# Altium schematic sheet hdmi_to_8pin_header.SchDoc
size A4
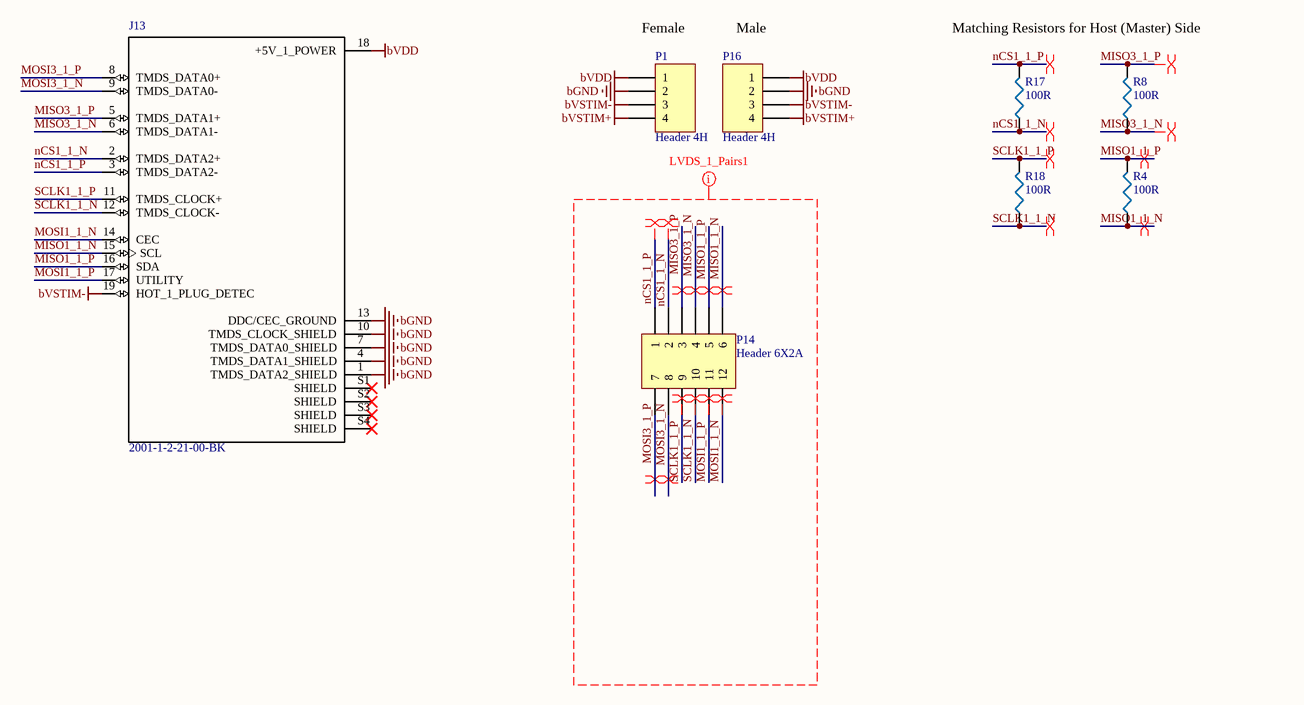
[diagram p0: hdmi_to_8pin_header.SchDoc]

## Parts
J13  2001-1-2-21-00-BK  [*CNC_2001-1-2-21-00-BK_2001-1-2-21-00-BK(Primary)]
P1  Header 4H  [PPTC041LGBN-RC]
P14  Header 6X2A  [PPPC062LJBN-RC]
P16  Header 4H  [PEC04SBAN]
R4  100R  [R0805]
R8  100R  [R0805]
R17  100R  [R0805]
R18  100R  [R0805]

## Nets
bGND: J13.1(TMDS_DATA2_SHIELD) J13.4(TMDS_DATA1_SHIELD) J13.7(TMDS_DATA0_SHIELD) J13.10(TMDS_CLOCK_SHIELD) J13.13(DDC/CEC_GROUND) P1.2 P16.2
bVDD: J13.18(+5V_1_POWER) P1.1 P16.1
bVSTIM+: P1.4 P16.4
bVSTIM-: J13.19(HOT_1_PLUG_DETEC) P1.3 P16.3
MISO1_1_N: J13.15(SCL) P14.6 R4.1
MISO1_1_P: J13.16(SDA) P14.5 R4.2
MISO3_1_N: J13.6(TMDS_DATA1-) P14.4 R8.1
MISO3_1_P: J13.5(TMDS_DATA1+) P14.3 R8.2
MOSI1_1_N: J13.14(CEC) P14.12
MOSI1_1_P: J13.17(UTILITY) P14.11
MOSI3_1_N: J13.9(TMDS_DATA0-) P14.8
MOSI3_1_P: J13.8(TMDS_DATA0+) P14.7
nCS1_1_N: J13.2(TMDS_DATA2+) P14.2 R17.1
nCS1_1_P: J13.3(TMDS_DATA2-) P14.1 R17.2
SCLK1_1_N: J13.12(TMDS_CLOCK-) P14.10 R18.1
SCLK1_1_P: J13.11(TMDS_CLOCK+) P14.9 R18.2

Not connected (* = marked no-connect by the designer): J13 S1(SHIELD)* S2(SHIELD)* S3(SHIELD)* S4(SHIELD)*

## Layout directives
differential pair: MISO1_1_N, MISO1_1_P, MISO3_1_N, MISO3_1_P, MOSI1_1_N, MOSI1_1_P, MOSI3_1_N, MOSI3_1_P, nCS1_1_N, nCS1_1_P, SCLK1_1_N, SCLK1_1_P
net class LVDS_1_Pairs1: MISO1_1_N, MISO1_1_P, MISO3_1_N, MISO3_1_P, MOSI1_1_N, MOSI1_1_P, MOSI3_1_N, MOSI3_1_P, nCS1_1_N, nCS1_1_P, SCLK1_1_N, SCLK1_1_P

## Notes on the sheet
- (near P1) Female
- (near P16) Male
- Matching Resistors for Host (Master) Side

## Library data of the parts
J13 = 2001-1-2-21-00-BK: Mini Hdmi 19p Female Smt; Manufacturer: CNC Tech; Pricing1: Price Break  Unit Price  Extended Price  1  2.69000  $2.69  10  2.43900  $24.39  25  2.28960  $57.24  50  2.19000  $109.50  100  2.09050  $209.05  250  1.89140  $472.85  500  1.74208  $871.04 (CAD); Digi-Key_Part_Number: 1175-1704-1-ND; Digi-Key_Purchase_URL: https://www.digikey.com/product-detail/en/cnc-tech/2001-1-2-21-00-BK/1175-1704-1-ND/4867013?utm_source=snapeda&utm_medium=aggregator&utm_campaign=symbol; Manufacturer Part Number: 2001-1-2-21-00-BK; SnapEDA_Link: https://www.snapeda.com/parts/2001-1-2-21-00-BK/CNC%20Tech/view-part/?ref=snap; Supplier 1: Digikey; Supplier Part Number 1: 1175-1704-1-ND; Supplier Link 1: https://www.digikey.ca/product-detail/en/cnc-tech/2001-1-2-21-00-BK/1175-1704-1-ND/4867013; Stock1: 3,276; ComponentLink1URL: http://cnctech.us/pdfs/2001-1-2-21-00-BK.pdf; ComponentLink1Description: Datasheet
P1 = Header 4H: Header, 4-Pin, Right Angle; Manufacturer: Sullins Connector Solutions; Pricing1: Price Break  Unit Price  Extended Price  1  0.79000  $0.79  10  0.73700  $7.37  100  0.56490  $56.49  500  0.49124  $245.62  1,000  0.40528  $405.28  5,000  0.35615  $1,780.73  10,000  0.35478  $3,547.80 (CAD); Detailed Description: 4 Position Header Connector 0.100" (2.54mm) Through Hole, Right Angle Tin; LatestRevisionDate: 17-Jul-2002; LatestRevisionNote: Re-released for DXP Platform.; Publisher: Altium Limited; Manufacturer Part Number: PPTC041LGBN-RC; Manufacturer Link: https://www.sullinscorp.com/product/?pn=PPTC041LGBN-RC&toggle=in; Supplier 1: Digikey; Supplier Part Number 1: S5440-ND; Supplier Link 1: https://www.digikey.ca/product-detail/en/sullins-connector-solutions/PPTC041LGBN-RC/S5440-ND/775898; Stock1: 12,644; ComponentLink1URL: https://drawings-pdf.s3.amazonaws.com/10493.pdf; ComponentLink1Description: Datasheet
P14 = Header 6X2A: Header, 6-Pin, Dual row; Manufacturer: Sullins Connector Solutions; Pricing1: 1  1.80000  $1.80  10  1.57700  $15.77  100  1.36070  $136.07  500  1.11330  $556.65  1,000  0.98959  $989.59  5,000  0.89338  $4,466.92 (CAD); LatestRevisionDate: 17-Jul-2002; LatestRevisionNote: Re-released for DXP Platform.; Publisher: Altium Limited; Manufacturer Part Number: PPPC062LJBN-RC; Manufacturer Link: https://www.sullinscorp.com/product/?pn=PPPC062LJBN-RC&toggle=in; Supplier 1: Digikey; Supplier Link 1: https://www.digikey.ca/product-detail/en/sullins-connector-solutions/PPPC062LJBN-RC/S5559-ND/776017; Supplier Part Number 1: S5559-ND; Stock1: 7,855; ComponentLink1URL: https://drawings-pdf.s3.amazonaws.com/10494.pdf; ComponentLink1Description: Datasheet
P16 = Header 4H: Header, 4-Pin, Right Angle; Manufacturer: Sullins Connector Solutions; pricing1: Price Break  Unit Price  Extended Price  1  0.54000  $0.54  10  0.50800  $5.08  25  0.43560  $10.89  50  0.37020  $18.51  100  0.35560  $35.56  250  0.31940  $79.85  500  0.30486  $152.43 (CAD); LatestRevisionDate: 17-Jul-2002; LatestRevisionNote: Re-released for DXP Platform.; Publisher: Altium Limited; Manufacturer Part Number: PEC04SBAN; Manufacturer Link: https://www.sullinscorp.com/product/?pn=PPPC181LFBN-RC&toggle=in#; Supplier 1: Digikey; Supplier Part Number 1: S1112E-04-ND; Supplier Link 1: https://www.digikey.ca/product-detail/en/sullins-connector-solutions/PEC04SBAN/S1112E-04-ND/860093; Stock1: 2,184; ComponentLink1URL: https://drawings-pdf.s3.amazonaws.com/10492.pdf; ComponentLink1Description: Datasheet
R4 R8 R17 R18 = RES100: ERJ-6ENF1000V; Manufacturer: Panasonic Electronic Components; Tolerance: 1%; Temperature Coefficient: 100ppm/°C; Power Rating: 125mW; Voltage Rating: 150V; Supplier 1: Digi-Key; Manufacturer Part Number: ERJ-6ENF1000V; Stock 1: 1859281; Pricing 1: 1=0.16;  10=0.15;  100=0.05760;  1000=0.02535;  2500=0.02190  (CAD); Case/Package: 0805; Case Code (Metric): 2012; Case Code (Imperial): 0805; Min Operating Temperature: -55°C; Max Operating Temperature: 155°C; Resistance: 100R; Packaging: Paper Tape; Composition: Thick Film; Package Quantity: 1; Number of Terminations: 2; Termination: SMD/SMT; Military Standard: Not; Max Power Dissipation: 125mW; REACH SVHC: Unknown; Lead Free: Lead Free; ComponentLink1URL: https://industrial.panasonic.com/cdbs/www-data/pdf/RDA0000/AOA0000C304.pdf; ComponentLink1Description: Datasheet; ComponentLink2URL: https://industrial.panasonic.com/ww/products/resistors/chip-resistors/general-purpose-chip-resistors/precision-thick-film-chip-resistors/ERJ6ENF1000V; ComponentLink2Description: Specifications; Supplier Part Number 1: P100CCT-ND; Weight: 4mg; Length: 2mm; Width: 1.25mm; Supplier Link 1: https://www.digikey.ca/product-detail/en/panasonic-electronic-components/ERJ-6ENF1000V/P100CCT-ND/118668